# EAGLE schematic test1 (EAGLE 7.2.0)
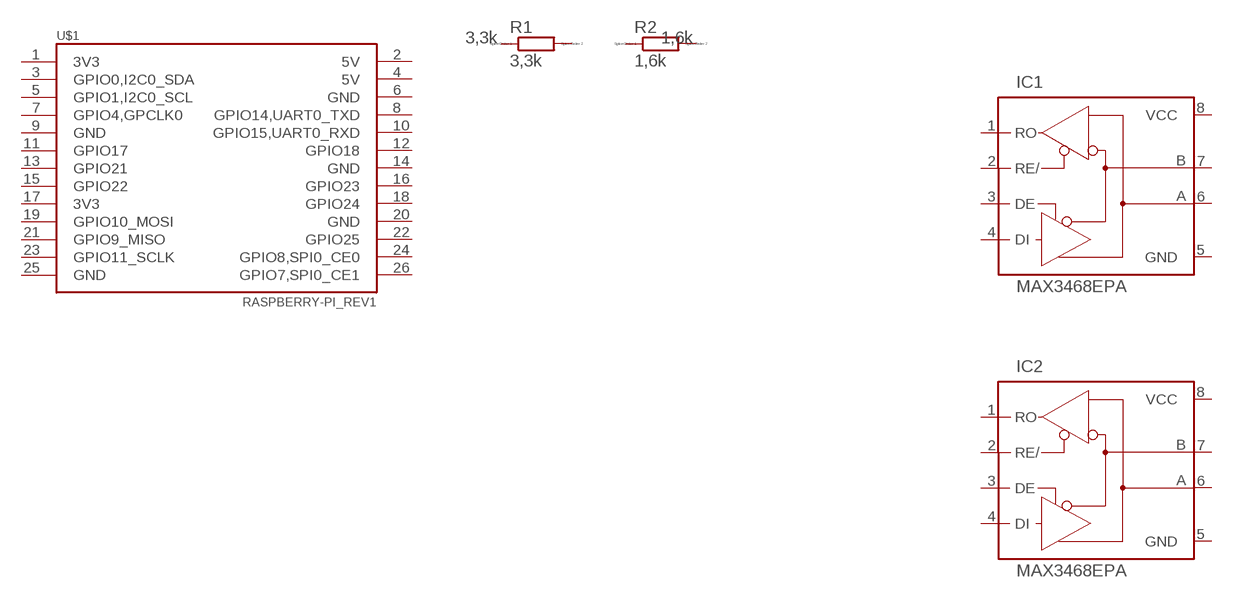
[diagram p0: schematic, sheet 1]

## Parts
IC1  MAX3468EPA  [DIL08]
IC2  MAX3468EPA  [DIL08]
R1  3,3k  R0204/7  [0204/7]
R2  1,6k  R0204/7  [0204/7]
U$1  RASPBERRY-PI_REV1  [RASPBERRY-PI_REV1]
Unconnected: IC1.1(RO) IC1.2(RE/) IC1.3(DE) IC1.4(DI) IC1.6(A) IC1.7(B) IC2.1(RO) IC2.2(RE/) IC2.3(DE) IC2.4(DI) IC2.6(A) IC2.7(B) R1.1 R1.2 R2.1 R2.2 U$1.1(3V3) U$1.2(5V) U$1.3(GPIO0,I2C0_SDA) U$1.4(5V) U$1.5(GPIO1,I2C0_SCL) U$1.6(GND) U$1.7(GPIO4,GPCLK0) U$1.8(GPIO14,UART0_TXD) U$1.9(GND) U$1.10(GPIO15,UART0_RXD) U$1.11(GPIO17) U$1.12(GPIO18) U$1.13(GPIO21) U$1.14(GND) U$1.15(GPIO22) U$1.16(GPIO23) U$1.17(3V3) U$1.18(GPIO24) U$1.19(GPIO10_MOSI) U$1.20(GND) U$1.21(GPIO9_MISO) U$1.22(GPIO25) U$1.23(GPIO11_SCLK) U$1.24(GPIO8,SPI0_CE0) U$1.25(GND) U$1.26(GPIO7,SPI0_CE1)

## Power pins joined to a net without a drawn wire
GND: IC1.5(GND) IC2.5(GND)
VCC: IC1.8(VCC) IC2.8(VCC)

## Library data of the parts
IC1 IC2 = maxim:MAX34*: +5V, Fail-Safe, 40Mbps, Profibus RS-485/RS-422 Transceivers Source: MAX3465-MAX3469.pdf; MPN: MAX3468EPA+; OC_FARNELL: unknown; OC_NEWARK: 78M5804
R1 = eagle-ltspice:R: RESISTOR, European symbol; SPICEMODEL: 3,3k; SPICEPREFIX: R
R2 = eagle-ltspice:R: RESISTOR, European symbol; SPICEMODEL: 1,6k; SPICEPREFIX: R
U$1 = RaspberryPi:RASPBERRY-PI_REV1: Raspberry Pi Board <http://www.raspberrypi.org/> Jacques Lagnel V1.0 (beta) 2012 Mateusz Bawaj V1.1 (beta) 2012 Board dimension: Forum 3D model <http://www.raspberrypi.org/forum/general-discussion/mechanical-profile-3d-models?value=3d%20model&type=1&include=1&search=1&ret=all> The GPIO Connector (P1): http://elinux.org/RPi_Low-level_peripherals